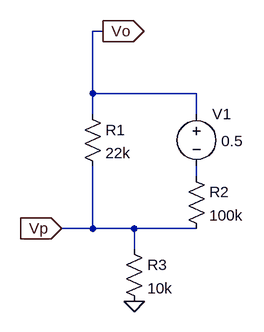
[diagram p0: schematic Draft2.asc]
Draft2.asc, the LTspice schematic file:
Version 4.1
SHEET 1 880 680
WIRE 144 -48 128 -48
WIRE 128 48 128 -48
WIRE 288 48 128 48
WIRE 128 80 128 48
WIRE 288 80 288 48
WIRE 288 176 288 160
WIRE 128 256 128 160
WIRE 128 256 80 256
WIRE 192 256 128 256
WIRE 288 256 192 256
WIRE 192 288 192 256
FLAG 192 368 0
FLAG 144 -48 Vo
IOPIN 144 -48 Out
FLAG 80 256 Vp
IOPIN 80 256 In
SYMBOL res 112 64 R0
SYMATTR InstName R1
SYMATTR Value 22k
SYMBOL res 272 160 R0
SYMATTR InstName R2
SYMATTR Value 100k
SYMBOL res 176 272 R0
SYMATTR InstName R3
SYMATTR Value 10k
SYMBOL voltage 288 64 R0
WINDOW 3 38 57 Left 2
WINDOW 123 0 0 Left 0
WINDOW 39 0 0 Left 0
SYMATTR InstName V1
SYMATTR Value 0.5

The netlist it stands for:
* Draft2.asc
R1 Vo Vp 22k
R2 N001 Vp 100k
R3 Vp 0 10k
V1 Vo N001 0.5
.backanno
.end